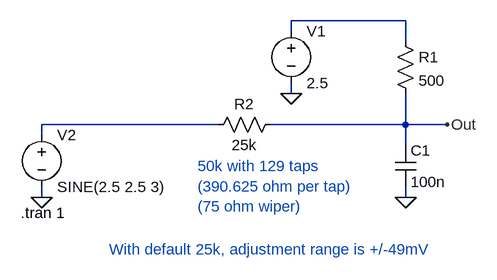
[diagram p0: schematic Offset trim.asc]
Offset trim.asc, the LTspice schematic file:
Version 4
SHEET 1 880 680
WIRE 176 -64 0 -64
WIRE 0 -48 0 -64
WIRE 176 -32 176 -64
WIRE 0 48 0 32
WIRE -112 96 -384 96
WIRE 176 96 176 48
WIRE 176 96 -32 96
WIRE 240 96 176 96
WIRE -384 112 -384 96
WIRE 176 128 176 96
WIRE -384 208 -384 192
WIRE 176 208 176 192
FLAG 0 48 0
FLAG 176 208 0
FLAG -384 208 0
FLAG 240 96 Out
SYMBOL cap 160 128 R0
SYMATTR InstName C1
SYMATTR Value 100n
SYMBOL res 160 -48 R0
SYMATTR InstName R1
SYMATTR Value 500
SYMBOL voltage 0 -64 R0
WINDOW 123 0 0 Left 0
WINDOW 39 0 0 Left 0
SYMATTR InstName V1
SYMATTR Value 2.5
SYMBOL res -16 80 R90
WINDOW 0 0 56 VBottom 2
WINDOW 3 32 56 VTop 2
SYMATTR InstName R2
SYMATTR Value 25k
SYMBOL voltage -384 96 R0
WINDOW 123 0 0 Left 0
WINDOW 39 0 0 Left 0
SYMATTR InstName V2
SYMATTR Value SINE(2.5 2.5 3)
TEXT -416 232 Left 2 !.tran 1
TEXT -144 160 Left 2 ;50k with 129 taps\n(390.625 ohm per tap)\n(75 ohm wiper)
TEXT -280 288 Left 2 ;With default 25k, adjustment range is +/-49mV

The netlist it stands for:
* Offset trim.asc
C1 Out 0 100n
R1 N001 Out 500
V1 N001 0 2.5
R2 Out N002 25k
V2 N002 0 SINE(2.5 2.5 3)
.tran 1
* 50k with 129 taps
* (390.625 ohm per tap)
* (75 ohm wiper)
* With default 25k, adjustment range is +/-49mV
.backanno
.end